# EAGLE design MCB-MTS-Dragonfly-v2.1.0 (EAGLE 7.7.0)

## Sheet 1 of 2
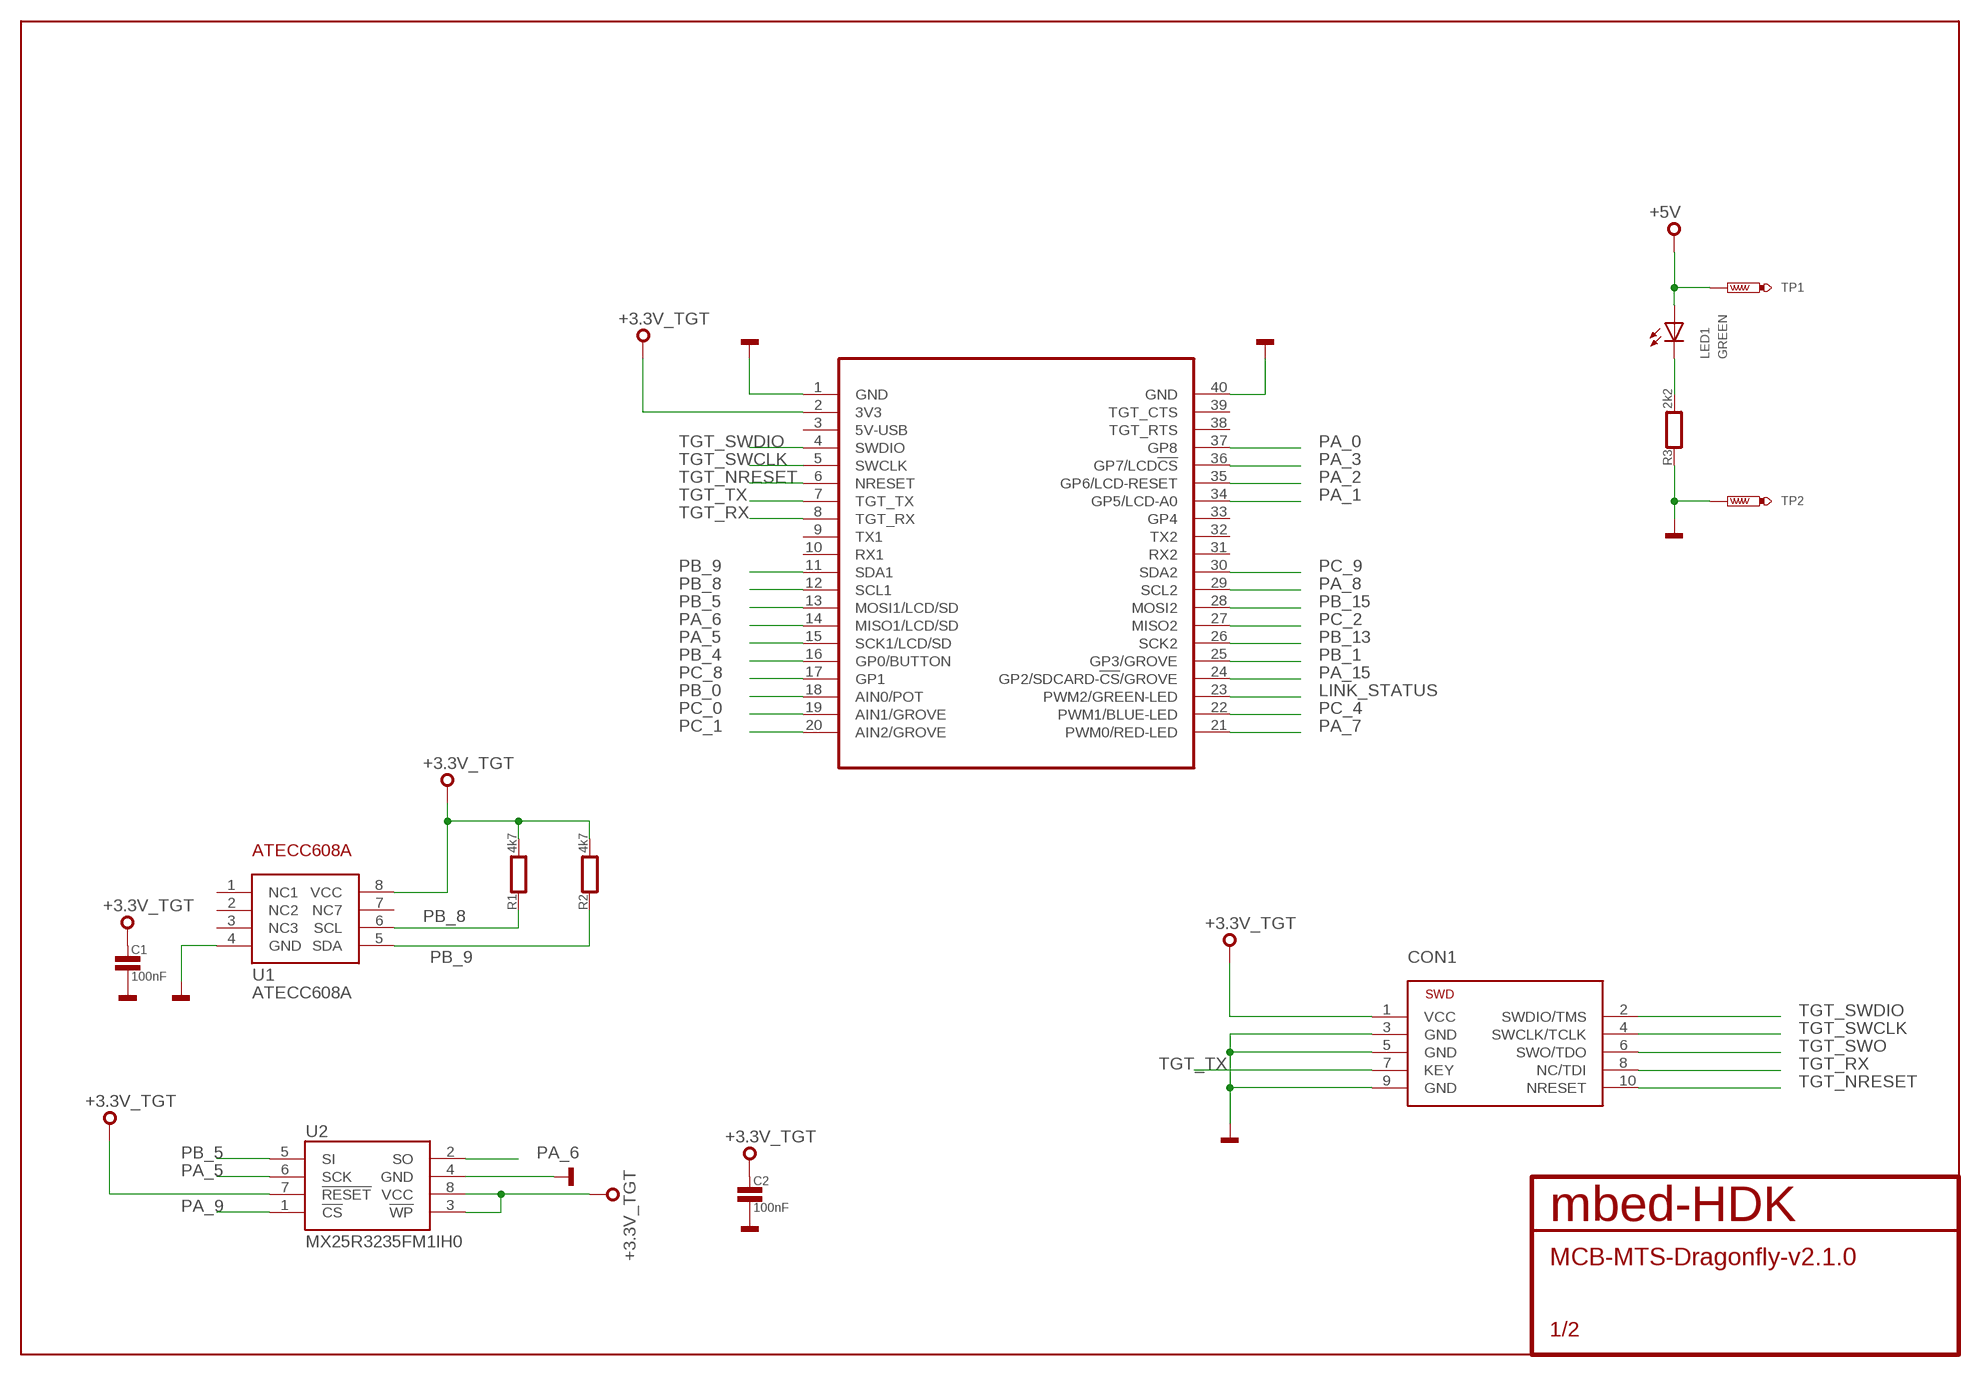
[diagram p0: schematic, sheet 1]

### Parts
C1  100nF  C0603  [0603]
C2  100nF  C0603  [0603]
CON1  SWD-10-SMD  [SWD-10-SMD]
LED1  GREEN  SMD_LED0603  [CHIPLED_0603]
MOD1  MODULE_DAUGHTER  [MODULE_DAUGHTER]
R1  4k7  R0603  [0603]
R2  4k7  R0603  [0603]
R3  2k2  R0603  [0603]
TP1  TEST_POINT-50R-PTH  [TP50-PTH]
TP2  TEST_POINT-50R-PTH  [TP50-PTH]
U1  ATECC608A  [SO8]
U2  MX25R3235FM1IH0  [SO8]

### Nets
+3.3V_TGT: C1.1 C2.1 CON1.1(VCC) MOD1.2(3V3) R1.2 R2.2 U1.8(VCC) U2.3(!WP) U2.7(!RESET) U2.8(VCC)
+5V: LED1.A TP1.TP ; also sheet 2
GND: C1.2 C2.2 CON1.3(GND) CON1.5(GND) CON1.9(GND) MOD1.1(GND) MOD1.40(GND) R3.1 TP2.TP U1.4(GND) U2.4(GND) ; also sheet 2
LINK_STATUS: MOD1.23(PWM2/GREEN-LED) ; also sheet 2
N$1: LED1.C R3.2
PA_0: MOD1.37(GP8) ; also sheet 2
PA_1: MOD1.34(GP5/LCD-A0) ; also sheet 2
PA_2: MOD1.35(GP6/LCD-RESET) ; also sheet 2
PA_3: MOD1.36(GP7/LCD!CS) ; also sheet 2
PA_5: MOD1.15(SCK1/LCD/SD) U2.6(SCK) ; also sheet 2
PA_6: MOD1.14(MISO1/LCD/SD) U2.2(SO) ; also sheet 2
PA_7: MOD1.21(PWM0/RED-LED) ; also sheet 2
PA_8: MOD1.29(SCL2) ; also sheet 2
PA_9: U2.1(!CS) ; also sheet 2
PA_15: MOD1.24(GP2/SDCARD-!CS!/GROVE) ; also sheet 2
PB_0: MOD1.18(AIN0/POT) ; also sheet 2
PB_1: MOD1.25(GP3/GROVE) ; also sheet 2
PB_4: MOD1.16(GP0/BUTTON) ; also sheet 2
PB_5: MOD1.13(MOSI1/LCD/SD) U2.5(SI) ; also sheet 2
PB_8: MOD1.12(SCL1) R1.1 U1.6(SCL) ; also sheet 2
PB_9: MOD1.11(SDA1) R2.1 U1.5(SDA) ; also sheet 2
PB_13: MOD1.26(SCK2) ; also sheet 2
PB_15: MOD1.28(MOSI2) ; also sheet 2
PC_0: MOD1.19(AIN1/GROVE) ; also sheet 2
PC_1: MOD1.20(AIN2/GROVE) ; also sheet 2
PC_2: MOD1.27(MISO2) ; also sheet 2
PC_4: MOD1.22(PWM1/BLUE-LED) ; also sheet 2
PC_8: MOD1.17(GP1) ; also sheet 2
PC_9: MOD1.30(SDA2) ; also sheet 2
TGT_NRESET: CON1.10(NRESET) MOD1.6(NRESET) ; also sheet 2
TGT_RX: CON1.8(NC/TDI) MOD1.8(TGT_RX) ; also sheet 2
TGT_SWCLK: CON1.4(SWCLK/TCLK) MOD1.5(SWCLK) ; also sheet 2
TGT_SWDIO: CON1.2(SWDIO/TMS) MOD1.4(SWDIO) ; also sheet 2
TGT_SWO: CON1.6(SWO/TDO) ; also sheet 2
TGT_TX: CON1.7(KEY) MOD1.7(TGT_TX) ; also sheet 2
Unconnected: MOD1.3(5V-USB) MOD1.9(TX1) MOD1.10(RX1) MOD1.31(RX2) MOD1.32(TX2) MOD1.33(GP4) MOD1.38(TGT_RTS) MOD1.39(TGT_CTS) U1.1(NC1) U1.2(NC2) U1.3(NC3) U1.7(NC7)

## Sheet 2 of 2
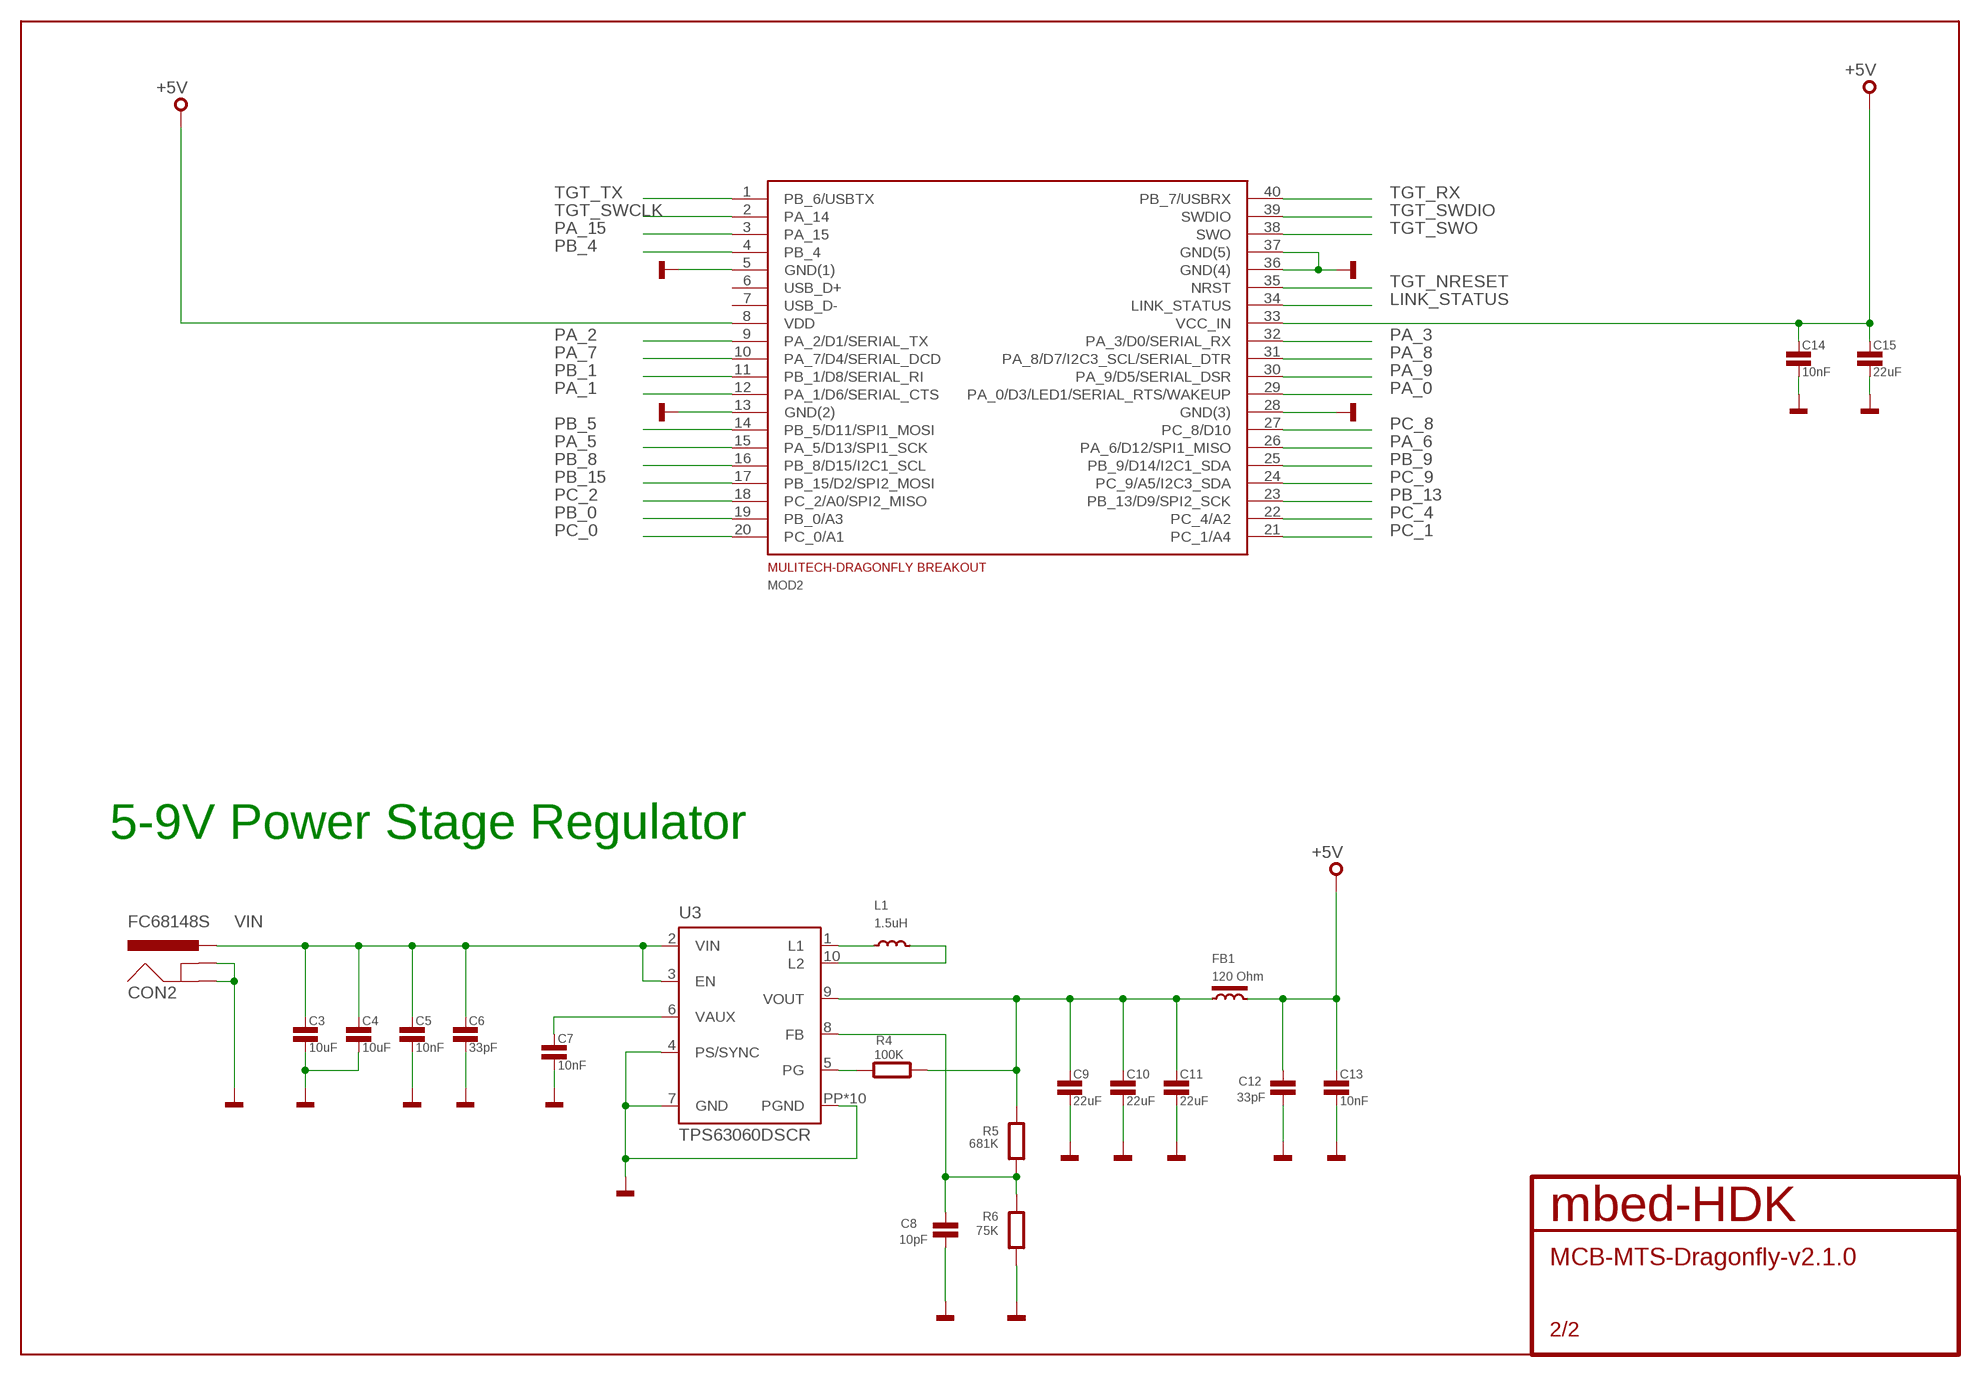
[diagram p1: schematic, sheet 2]

### Parts
C3  10uF  C0603  [0603]
C4  10uF  C0603  [0603]
C5  10nF  C0603  [0603]
C6  33pF  C0603  [0603]
C7  10nF  C0603  [0603]
C8  10pF  C0603  [0603]
C9  22uF  C0603  [0603]
C10  22uF  C0603  [0603]
C11  22uF  C0603  [0603]
C12  33pF  C0603  [0603]
C13  10nF  C0603  [0603]
C14  10nF  C0603  [0603]
C15  22uF  C0603  [0603]
CON2  FC68148S  [FC68148S]
FB1  120 Ohm  FB0603  [0603]
L1  1.5uH  INDUCTORXFL4020  [XFL4020-472MEC]
MOD2  MULITECH-DRAGONFLY-BREAKOUT  [MULITECH-DRAGONFLY-BREAKOUT]
R4  100K  R0603  [0603]
R5  681K  R0603  [0603]
R6  75K  R0603  [0603]
U3  TPS63060DSCR  [DSC-S-PWSON-N10]

### Nets
+5V: C12.1 C13.1 C14.1 C15.1 FB1.2 MOD2.8(VDD) MOD2.33(VCC_IN) ; also sheet 1
GND: C3.2 C4.2 C5.2 C6.2 C7.2 C8.2 C9.2 C10.2 C11.2 C12.2 C13.2 C14.2 C15.2 CON2.2(GNDBREAK) CON2.3(GND) MOD2.5(GND(1)) MOD2.13(GND(2)) MOD2.28(GND(3)) MOD2.36(GND(4)) MOD2.37(GND(5)) R6.1 U3.4(PS/SYNC) U3.7(GND) U3.PP(PGND) U3.PP@1(PGND) U3.PP@2(PGND) U3.PP@3(PGND) U3.PP@4(PGND) U3.PP@5(PGND) U3.PP@7(PGND) U3.PP@8(PGND) U3.PP@9(PGND) U3.PP@10(PGND) ; also sheet 1
LINK_STATUS: MOD2.34(LINK_STATUS) ; also sheet 1
N$17: C7.1 U3.6(VAUX)
N$18: L1.P$1 U3.1(L1)
N$19: L1.P$2 U3.10(L2)
N$20: C8.1 R5.1 R6.2 U3.8(FB)
N$21: C9.1 C10.1 C11.1 FB1.1 R4.2 R5.2 U3.9(VOUT)
N$23: R4.1 U3.5(PG)
PA_0: MOD2.29(PA_0/D3/LED1/SERIAL_RTS/WAKEUP) ; also sheet 1
PA_1: MOD2.12(PA_1/D6/SERIAL_CTS) ; also sheet 1
PA_2: MOD2.9(PA_2/D1/SERIAL_TX) ; also sheet 1
PA_3: MOD2.32(PA_3/D0/SERIAL_RX) ; also sheet 1
PA_5: MOD2.15(PA_5/D13/SPI1_SCK) ; also sheet 1
PA_6: MOD2.26(PA_6/D12/SPI1_MISO) ; also sheet 1
PA_7: MOD2.10(PA_7/D4/SERIAL_DCD) ; also sheet 1
PA_8: MOD2.31(PA_8/D7/I2C3_SCL/SERIAL_DTR) ; also sheet 1
PA_9: MOD2.30(PA_9/D5/SERIAL_DSR) ; also sheet 1
PA_15: MOD2.3(PA_15) ; also sheet 1
PB_0: MOD2.19(PB_0/A3) ; also sheet 1
PB_1: MOD2.11(PB_1/D8/SERIAL_RI) ; also sheet 1
PB_4: MOD2.4(PB_4) ; also sheet 1
PB_5: MOD2.14(PB_5/D11/SPI1_MOSI) ; also sheet 1
PB_8: MOD2.16(PB_8/D15/I2C1_SCL) ; also sheet 1
PB_9: MOD2.25(PB_9/D14/I2C1_SDA) ; also sheet 1
PB_13: MOD2.23(PB_13/D9/SPI2_SCK) ; also sheet 1
PB_15: MOD2.17(PB_15/D2/SPI2_MOSI) ; also sheet 1
PC_0: MOD2.20(PC_0/A1) ; also sheet 1
PC_1: MOD2.21(PC_1/A4) ; also sheet 1
PC_2: MOD2.18(PC_2/A0/SPI2_MISO) ; also sheet 1
PC_4: MOD2.22(PC_4/A2) ; also sheet 1
PC_8: MOD2.27(PC_8/D10) ; also sheet 1
PC_9: MOD2.24(PC_9/A5/I2C3_SDA) ; also sheet 1
TGT_NRESET: MOD2.35(NRST) ; also sheet 1
TGT_RX: MOD2.40(PB_7/USBRX) ; also sheet 1
TGT_SWCLK: MOD2.2(PA_14) ; also sheet 1
TGT_SWDIO: MOD2.39(SWDIO) ; also sheet 1
TGT_SWO: MOD2.38(SWO) ; also sheet 1
TGT_TX: MOD2.1(PB_6/USBTX) ; also sheet 1
VIN: C3.1 C4.1 C5.1 C6.1 CON2.1-1(PWR) CON2.1-2(PWR) U3.2(VIN) U3.3(EN)
Unconnected: MOD2.6(USB_D+) MOD2.7(USB_D-)

### Notes on the sheet
- 5-9V Power Stage Regulator

## Library data of the parts
C1-C15 = mbed-HDK-RLC:C: Capacitor
CON1 = mbed-HDK-Connector:SWD-10: 1.27 mm pitch 10-Pin Cortex Programming Header
CON2 = mbed-HDK-Connector:FC68148S: Power Jack This is the standard 5.5mm barrel jack for power. The PTH is the most common, proven, reliable, footprint. The Slot footprint only works if the mill layer is transmitted to the PCB fab house so be warned. Mating wall wart : TOL-00298 (and others); MF: Cliff; MFN: FC68148S; OC_NEWARK: 1889309
FB1 = mbed-HDK-RLC:FB: Ferrite Bead
L1 = mbed-HDK-RLC:INDUCTOR: Inductor; MF: CoilCraft; MFN: XFL4020-472MEC; OC-NEWARK: 2289218
LED1 = mbed-HDK-Optical:SMD_LED: LED SMD, Colour Red; MF: Wurth Electronics Inc; MFN: 150060RS75000; OC-DIGIKEY: 732-4978-1-ND; OC-MOUSER: 710-150060RS75000; OC-NEWARK: 2322071
MOD1 = mbed-HDK-misc-Board:MODULE_DAUGHTER
MOD2 = mbed-HDK-MF-MULTITECH:MULITECH-DRAGONFLY-BREAKOUT: Breakout for Multitech Dragonfly; MF: Hirose; MFN: DF17(2.0)-40DP-0.5V(57); OC-DIGIKEY: H11130CT-ND; OC-MOUSER: 798-DF172040DP05V57; OC-NEWARK: 2300341
R1-R6 = mbed-HDK-RLC:R: Resistor
TP1 TP2 = mbed-HDK-Test:TEST_POINT
U1 = mbed-HDK-MF-ATMEL:ATECC608A: I2C Secure element and crytpo accelerator; MF: Atmel; MFN: ATECC608A; OC-DIGIKEY: ATECC608A-SSHDA-TCT-ND; OC-MOUSER: 556-ATECC608ASSHDAB
U2 = mbed-HDK-IC:MX25R3235FM1IH0: Serial Flash 32 Mb 80 Mhz; MF: Macronix; MFN: MX25R3235FM1IH0; OC-DIGIKEY: 1092-1175-ND
U3 = mbed-HDK-Power:TPS63060DSCR: Buck Boost Conveter (2.5V-12Vin, 2.5V-8Vout, 2Aout); MF: TEXAS INSTRUMENTS; MFN: TPS63060DSCR; OC-DIGIKEY: 296-30204-1-ND; OC-MOUSER: 595-TPS63060DSCR; OC-NEWARK: 76T8143

## Board
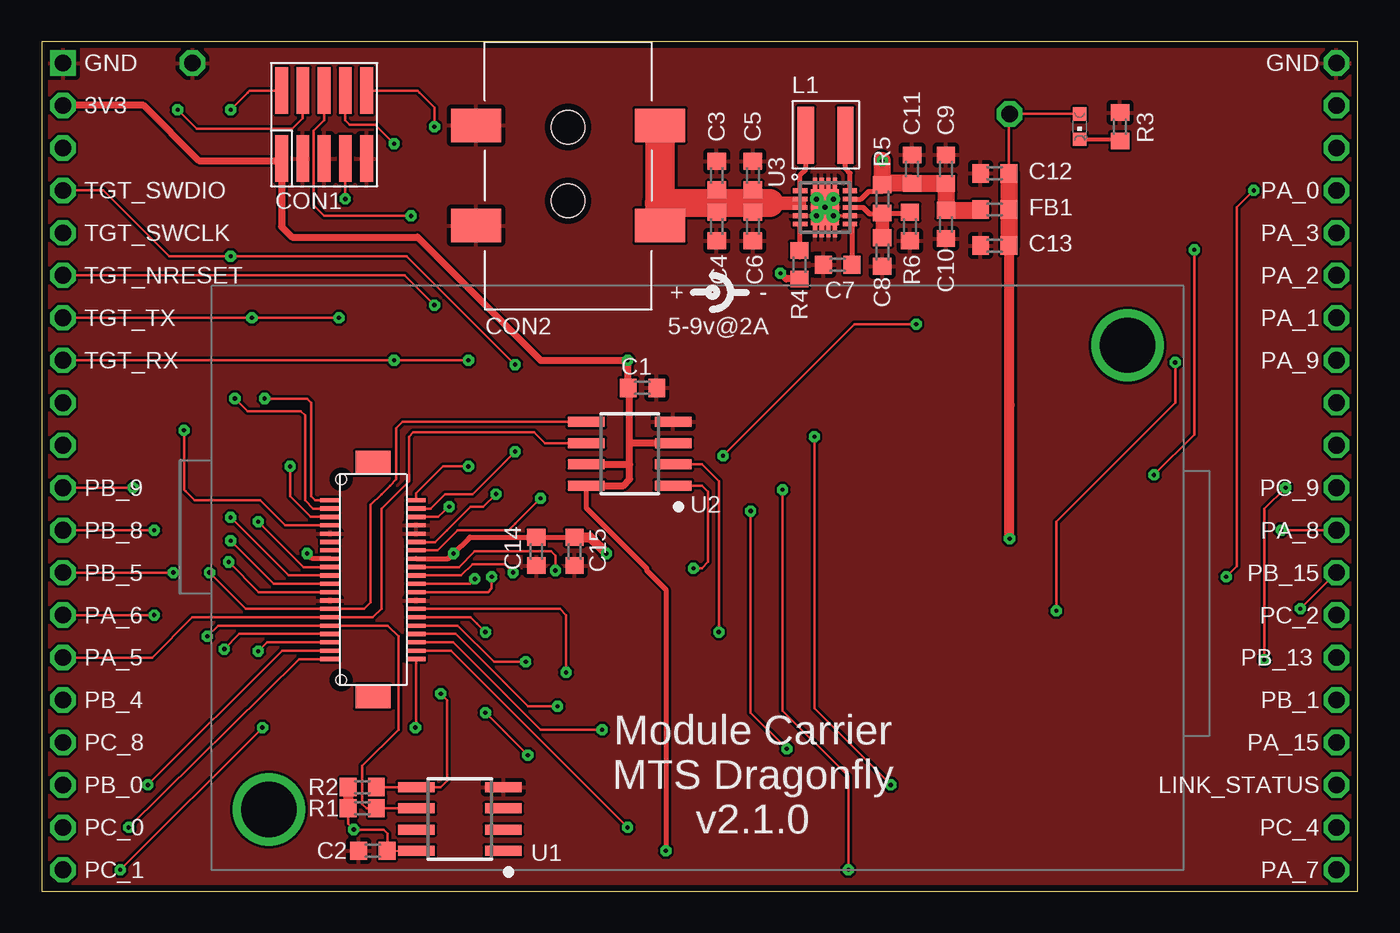
[diagram p2: board, top side]
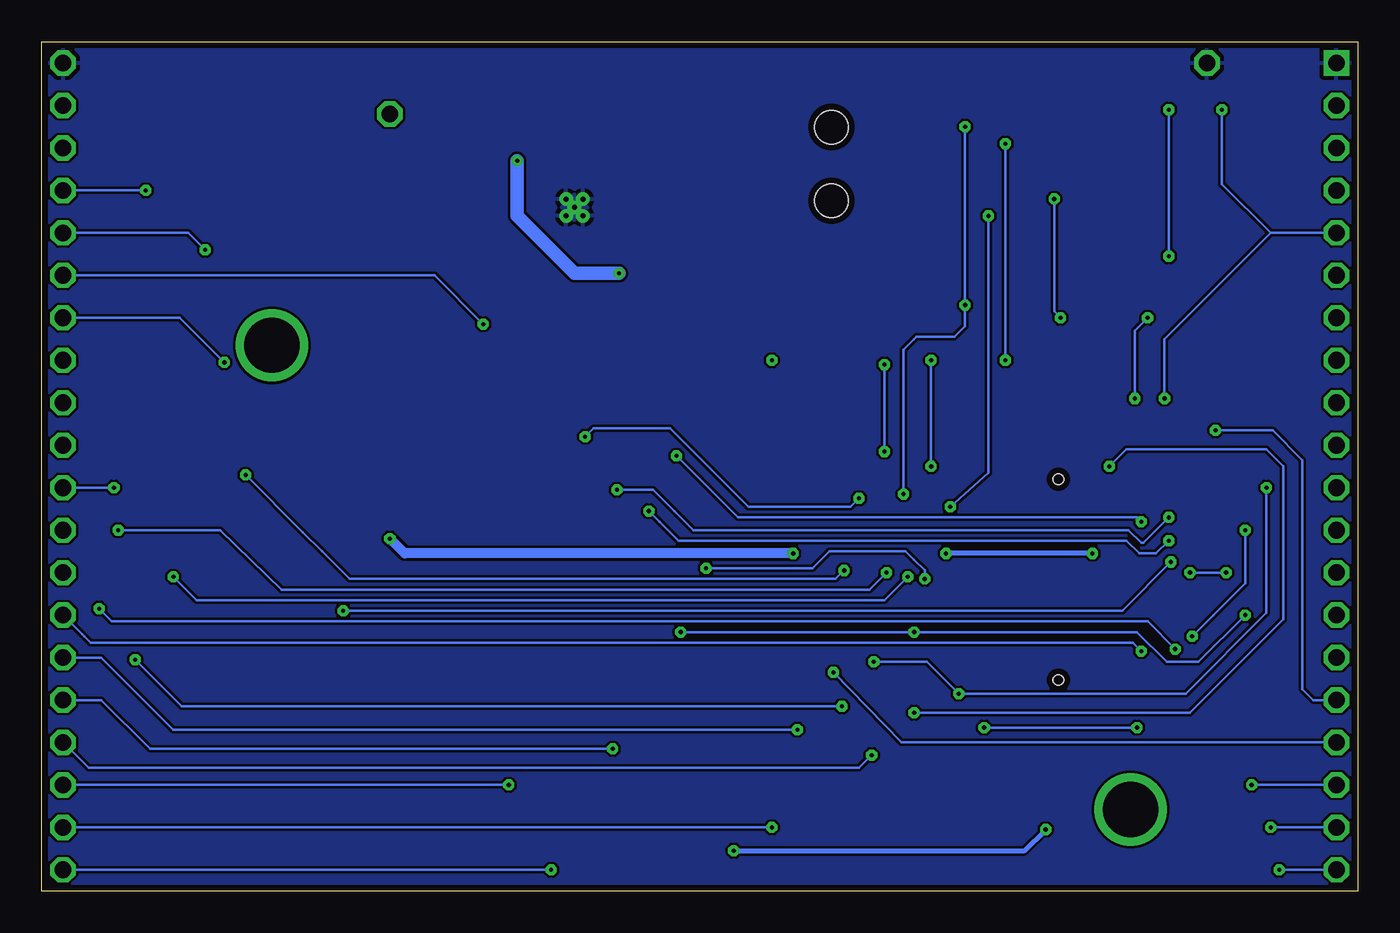
[diagram p3: board, bottom side, seen from below]

Size 78.74 x 50.8 mm. Coordinates in mm from the lower left corner, seen from the top.
Copper layers ((1*16)): Top 0.035mm / dielectric 0.8mm / Bottom 0.035mm
Design rules "mbed-HDK-6-6-2-layer": minimum track width 6mil, minimum drill 9mil, track to track 6mil, track to pad 6mil, pad to pad 6mil, via to via 6mil, smd to smd 6mil, copper to edge 15mil, drill to drill 8mil, minimum pad ring 10mil, minimum via ring 8mil, stop-mask expansion 4mil, vias tented up to drill 0mil, thermal gap 10mil

### Footprints (pad centres in the part's own frame; a part is rotated, then mirrored left to right if it is on the bottom)
0603 = smd 1 x 1.1: 1 -0.85,0; 2 0.85,0
SWD-10-SMD = smd 0.762 x 2.794: 1 0.381,-2.032; 2 0.381,2.032; 3 1.651,-2.032; 4 1.651,2.032; 5 2.921,-2.032; 6 2.921,2.032; 7 4.191,-2.032; 8 4.191,2.032; 9 5.461,-2.032; 10 5.461,2.032
FC68148S = smd 3 x 2: 1-1 5.5,-5; 1-2 5.5,-11; 2 -5.5,-11; 3 -5.5,-5 | hole 2: 0,-5.1; 0,-9.5
XFL4020-472MEC = smd 0.98 x 3.4: P$1 0,0; P$2 2.37,0
CHIPLED_0603 = smd 0.8 x 0.8: A 0,-0.75; C 0,0.75
MODULE_DAUGHTER = drill 1 square: 1 0,0 | drill 1 octagon: 2 0,-2.54; 3 0,-5.08; 4 0,-7.62; 5 0,-10.16; 6 0,-12.7; 7 0,-15.24; 8 0,-17.78; 9 0,-20.32; 10 0,-22.86; 11 0,-25.4; 12 0,-27.94; 13 0,-30.48; 14 0,-33.02; 15 0,-35.56; 16 0,-38.1; 17 0,-40.64; 18 0,-43.18; 19 0,-45.72; 20 0,-48.26; 21 76.2,-48.26; 22 76.2,-45.72; 23 76.2,-43.18; 24 76.2,-40.64; 25 76.2,-38.1; 26 76.2,-35.56; 27 76.2,-33.02; 28 76.2,-30.48; 29 76.2,-27.94; 30 76.2,-25.4; 31 76.2,-22.86; 32 76.2,-20.32; 33 76.2,-17.78; 34 76.2,-15.24; 35 76.2,-12.7; 36 76.2,-10.16; 37 76.2,-7.62; 38 76.2,-5.08; 39 76.2,-2.54; 40 76.2,0
MULITECH-DRAGONFLY-BREAKOUT = smd 0.25 x 1.15: 1 -22.11,7.08; 2 -21.61,7.08; 3 -21.11,7.08; 4 -20.61,7.08; 5 -20.11,7.08; 6 -19.61,7.08; 7 -19.11,7.08; 8 -18.61,7.08; 9 -18.11,7.08; 10 -17.61,7.08; 11 -17.11,7.08; 12 -16.61,7.08; 13 -16.11,7.08; 14 -15.61,7.08; 15 -15.11,7.08; 16 -14.61,7.08; 17 -14.11,7.08; 18 -13.61,7.08; 19 -13.11,7.08; 20 -12.61,7.08; 21 -12.61,12.23; 22 -13.11,12.23; 23 -13.61,12.23; 24 -14.11,12.23; 25 -14.61,12.23; 26 -15.11,12.23; 27 -15.61,12.23; 28 -16.11,12.23; 29 -16.61,12.23; 30 -17.11,12.23; 31 -17.61,12.23; 32 -18.11,12.23; 33 -18.61,12.23; 34 -19.11,12.23; 35 -19.61,12.23; 36 -20.11,12.23; 37 -20.61,12.23; 38 -21.11,12.23; 39 -21.61,12.23; 40 -22.11,12.23 | drill 3.3: P$1 -31.37,54.81; P$2 -3.61,3.43 | smd 1.4 x 2.1: P$43 -24.36,9.655; P$44 -10.36,9.655 | hole 0.6: -11.36,7.755; -23.36,7.755
TP50-PTH = drill 1 octagon: TP 0,0
SO8 = smd 0.6 x 2.2: 1 -1.905,-2.6; 2 -0.635,-2.6; 3 0.635,-2.6; 4 1.905,-2.6; 5 1.905,2.6; 6 0.635,2.6; 7 -0.635,2.6; 8 -1.905,2.6
DSC-S-PWSON-N10 = smd 0.85 x 0.28: 1 -1.488,1; 2 -1.488,0.5; 3 -1.488,0; 4 -1.488,-0.5; 5 -1.488,-1; 6 1.5,-1; 7 1.5,-0.5; 8 1.5,0; 9 1.5,0.5; 10 1.5,1 | smd 1.7 x 2.15: PP 0,0 | smd 0.25 x 3.55: PP@1 0.6,0; PP@2 0.2,0; PP@3 -0.2,0; PP@4 -0.6,0 | drill 0.3 pad 0.4: PP@5 0.5,0.5; PP@7 0,0; PP@8 0.5,-0.5; PP@9 -0.5,0.5; PP@10 -0.5,-0.5

### Placement (x,y rotation side)
C1  35.94,30.1 0 top
C2  19.81,2.41 180 top
C3  40.39,42.8 90 top
C4  40.39,39.75 270 top
C5  42.55,39.75 270 top
C6  42.55,42.8 90 top
C7  47.62,37.47 180 top
C8  50.29,38.23 270 top
C9  54.1,43.18 90 top
C10  54.1,39.88 270 top
C11  52.07,43.18 90 top
C12  57.02,42.93 180 top
C13  57.02,38.61 180 top
C14  29.59,20.32 270 top
C15  31.88,20.32 270 top
CON1  13.97,45.85 0 top
CON2  31.5,50.8 0 top
FB1  57.02,40.77 0 top
L1  45.72,45.21 0 top
LED1  62.1,45.72 180 top
MOD1  1.27,49.53 0 top
MOD2  10.16,1.27 270 top
R1  19.18,4.95 180 top
R2  19.18,6.22 180 top
R3  64.52,45.72 270 top
R4  45.34,37.47 270 top
R5  50.29,41.4 90 top
R6  51.94,39.75 90 top
TP1  57.91,46.48 0 top
TP2  9.02,49.53 0 top
U1  25.02,4.32 90 top
U2  35.18,26.16 90 top
U3  46.86,40.89 0 top

### Tracks (layer width: path | path; a pad name or v marks a point on that pad's centre or on a via)
+3.3V_TGT  (via drill 0.25, 0.25 pad 0.25)
  Top 0.152: U1.8 21.68,2.39 C2.1 20.7,2.45 20.7,3.43 20.45,3.68 v18.67,3.68 18.33,4.02 R1.2 | 35.18,30.01 C1.1 | 35.31,26.8 35.18,26.67 | 35.09,31.71 v35.05,31.75
  Top 0.305: U2.8 32.58,22.92 36.2,19.3 36.2,19.18 37.34,18.03 37.34,2.67 v37.34,2.41
  Top 0.406: MOD1.2 6.1,46.99 9.4,43.69 14.22,43.69 CON1.1 14.35,39.75 14.99,39.12 22.48,39.12 29.84,31.75 v35.05,31.75 | U2.8 34.8,24.26 35.18,24.64 35.18,25.53 | 35.18,25.53 35.18,26.67 35.18,30.01 | U2.7 35.18,25.53 | U2.3 35.31,26.8 | C1.1 35.09,31.71
  Top 0.61: R2.2 R1.2
  Bottom 0.305: v37.34,2.41 19.94,2.41 v18.67,3.68
+5V  (via drill 0.25, 0.25 pad 0.25)
  Top 0.152: C12.1 57.87,46.44 TP1.TP 62.09,46.48 LED1.A
  Top 0.305: C15.1 C14.1 25.61,21.17 25.53,21.08 v24.64,20.19 24.32,19.88 MOD2.33 | MOD2.8 16.19,19.88 v15.88,20.19
  Top 0.61: C15.1 32.8,21.17 v33.78,20.19 | v57.91,21.08 57.91,29.08 57.91,38.57 C13.1
  Top 1.016: C12.1 FB1.2 C13.1
  Bottom 0.305: v15.88,20.19 v24.64,20.19
  Bottom 0.61: v33.78,20.19 57.02,20.19 v57.91,21.08
GND
  Top 0.152: U3.7 U3.PP@8 | U3.PP@8 47.36,40.59 U3.PP@2 | U3.PP@1 47.46,40.49 U3.PP@8 | U3.PP@4 U3.PP@3 | U3.PP@3 U3.PP@7 | U3.PP@7 U3.PP@2 | U3.PP@2 U3.PP@7 | U3.PP@3 U3.PP@7
  pour Bottom: 0,0 78.74,0 78.74,50.8 0,50.8
  pour Top: 0,0 78.74,0 78.74,50.8 0,50.8
LINK_STATUS  (via drill 0.25)
  Top 0.152: MOD2.34 23.68,20.38 24.89,21.59 27.94,21.59 28.32,21.97 v29.84,23.5 | v50.8,6.35 46.23,10.92 v46.23,27.18
  Bottom 0.152: MOD1.23 v50.8,6.35 | v29.84,23.5 30.35,22.99 30.48,22.99 36.45,22.99 41.15,27.69 45.72,27.69 v46.23,27.18
N$1
  Top 0.254: LED1.C 64.52,44.97 R3.2
N$17
  Top 0.305: U3.6 48.48,39.78 C7.1
N$18
  Top 0.305: U3.1 45.38,42.84 45.72,43.18 L1.P$1
N$19
  Top 0.305: U3.10 48.36,42.95 48.09,43.22 L1.P$2
N$20
  Top 0.305: U3.8 49.15,40.89 49.53,40.51 50.25,40.51 R5.1 51.89,40.55 R6.2
  Top 0.813: R5.1 C8.1
N$21  (via drill 0.25)
  Top 0.152: 50.38,42.33 50.37,42.33 R5.2
  Top 0.305: U3.9 49.01,41.39 49.48,41.86 50.29,41.86 R5.2 50.29,42.42
  Top 0.406: R4.2 44.54,36.62 v44.2,36.96
  Top 1.016: v50.29,43.69 50.29,42.42 50.38,42.33 C11.1 C9.1 C10.1 56.13,40.73 FB1.1
  Bottom 0.813: v50.29,43.69 50.29,40.39 46.86,36.96 v44.2,36.96
N$23
  Top 0.152: R4.1 45.34,38.23
  Top 0.305: U3.5 45.34,39.86 R4.1 45.34,38.23 45.34,37.92
PA_0  (via drill 0.25, 0.25 pad 0.25)
  Top 0.152: MOD2.29 26.7,17.88 26.92,18.11 v26.92,18.8 | v70.87,18.8 71.5,19.43 71.5,40.89 v72.52,41.91
  Bottom 0.152: v26.92,18.8 28.32,17.4 69.47,17.4 v70.87,18.8 | v72.52,41.91 MOD1.37
PA_1  (via drill 0.25)
  Top 0.152: v67.82,31.62 67.82,29.21 60.71,22.1 v60.71,16.76 | MOD2.12 12.98,17.88 v11.18,19.69
  Bottom 0.152: MOD1.34 70.48,34.29 v67.82,31.62 | v60.71,16.76 60.33,16.76 14.1,16.76 v11.18,19.69
PA_2  (via drill 0.25)
  Top 0.152: v40.77,26.04 48.64,33.91 v52.32,33.91 | MOD2.9 15.67,19.38 v12.95,22.1
  Bottom 0.152: v12.95,22.1 13.21,22.35 36.96,22.35 37.08,22.35 v40.77,26.04 | v52.32,33.91 55.25,36.83 MOD1.35
PA_3  (via drill 0.25)
  Top 0.152: v68.96,38.35 68.96,27.3 v66.55,24.89 | MOD2.32 24.97,19.38 25.91,20.32 30.48,20.32 30.73,20.07 v30.73,19.18
  Bottom 0.152: v30.73,19.18 31.24,18.67 60.33,18.67 61.98,20.32 63.12,21.46 v66.55,24.89 | MOD1.36 69.98,39.37 v68.96,38.35
PA_5
  Top 0.152: MOD1.15 6.6,13.97 9.01,16.38 MOD2.15 19.81,16.38 20.32,16.89 20.32,22.86 21.97,24.51 21.97,27.18 22.22,27.43 29.46,27.43 30.1,26.8 U2.6
PA_6  (via drill 0.25, 0.25 pad 0.25)
  Top 0.152: MOD2.26 25.66,16.38 26.04,16 v26.54,15.49 | MOD1.14 v6.73,16.51 | U2.2 39.5,25.53 40.51,24.51 v40.51,15.49
  Bottom 0.152: v6.73,16.51 9.53,13.72 11.43,13.72 13.21,15.49 v26.54,15.49 v40.51,15.49
PA_7  (via drill 0.25)
  Top 0.152: v44.32,24 44.32,10.8 48.26,6.86 v48.26,1.27 | MOD2.10 14.78,18.88 v11.3,22.35
  Bottom 0.152: v11.3,22.35 12.83,20.83 12.95,20.83 13.72,21.59 39.75,21.59 40.89,22.73 42.16,24 v44.32,24 | v48.26,1.27 MOD1.21
PA_8  (via drill 0.25)
  Top 0.152: v74.17,21.59 MOD1.29 | MOD2.31 23.54,18.88 25.1,18.88 25.78,19.56 27.05,19.56 27.69,19.56 v28.19,19.05
  Bottom 0.152: v28.19,19.05 29.21,18.03 64.39,18.03 68.07,21.59 v74.17,21.59
PA_9  (via drill 0.25, 0.25 pad 0.25)
  Top 0.152: MOD2.30 25.62,18.38 v25.91,18.67 | v38.99,19.3 39.5,19.3 39.88,19.69 39.88,23.88 39.5,24.26 U2.1
  Bottom 0.152: v25.91,18.67 25.91,19.18 26.54,19.81 27.05,20.32 31.62,20.32 32.64,19.3 v38.99,19.3
PA_15  (via drill 0.25)
  Top 0.152: v29.08,8.13 v26.54,10.67 | MOD2.3 16.1,22.38 14.86,23.62 v14.86,25.4
  Bottom 0.152: MOD1.24 75.95,7.37 29.84,7.37 v29.08,8.13 | v26.54,10.67 10.03,10.67 4.45,16.26 4.45,25.4 5.46,26.42 13.84,26.42 v14.86,25.4
PB_0  (via drill 0.25)
  Top 0.152: MOD2.19 14.38,14.38 v6.35,6.35
  Bottom 0.152: v6.35,6.35 MOD1.18
PB_1  (via drill 0.25)
  Top 0.152: v42.42,22.73 42.42,10.67 v44.58,8.51 | MOD2.11 13.88,18.38 v11.3,20.96
  Bottom 0.152: v11.3,20.96 12.06,20.19 13.08,20.19 13.84,20.96 40.64,20.96 41.78,22.1 v42.42,22.73 | MOD1.25 75.18,11.43 72.26,8.51 v44.58,8.51
PB_4  (via drill 0.25)
  Top 0.152: v8.51,27.56 8.51,24 8.6,23.91 9.14,23.37 13.08,23.37 14.57,21.88 MOD2.4
  Bottom 0.152: MOD1.16 2.67,11.43 3.3,12.06 3.3,25.78 5.08,27.56 v8.51,27.56
PB_5  (via drill 0.25)
  Top 0.152: v10.03,19.05 12.2,16.88 MOD2.14 19.29,16.88 19.68,17.27 19.68,23.11 20.32,23.75 20.83,24.26 21.21,24.64 21.21,27.69 21.59,28.07 U2.5 | MOD1.13 v7.87,19.05
  Bottom 0.152: v7.87,19.05 v10.03,19.05
PB_8  (via drill 0.25)
  Top 0.152: v9.91,15.24 10.55,15.88 MOD2.16 20.7,15.88 21.34,15.24 21.34,11.43 21.34,10.03 21.34,9.65 19.18,7.49 19.18,5.21 19.43,4.95 R1.1 U1.6 | MOD1.12 v6.73,21.59
  Bottom 0.152: v9.91,15.24 8.64,16.51 6.73,18.42 v6.73,21.59
PB_9  (via drill 0.25)
  Top 0.152: MOD2.25 24.89,15.88 27.05,13.72 v28.96,13.72 | v5.46,24.13 MOD1.11 | R2.1 U1.5 23.88,6.22 24.26,6.6 24.26,11.43 v23.88,11.81
  Bottom 0.152: v28.96,13.72 25.78,13.72 v23.88,11.81 10.29,11.81 5.46,16.64 v5.46,24.13
PB_13  (via drill 0.25)
  Top 0.152: MOD2.23 24.62,14.88 29.84,9.65 v33.53,9.65
  Bottom 0.152: v33.53,9.65 70.87,9.65 75.18,13.97 MOD1.26
PB_15  (via drill 0.25)
  Top 0.152: MOD1.28 v75.31,16.89 | MOD2.17 11.82,15.38 v10.92,14.48
  Bottom 0.152: v10.92,14.48 12.57,16.13 27.43,16.13 28.45,16.13 74.55,16.13 v75.31,16.89
PC_0  (via drill 0.25)
  Top 0.152: MOD2.20 15.4,13.88 v5.21,3.81
  Bottom 0.152: v5.21,3.81 MOD1.19
PC_1  (via drill 0.25)
  Top 0.152: MOD2.21 22.39,9.56 v22.35,9.78 | v13.21,9.78 v4.7,1.27
  Bottom 0.152: v22.35,9.78 v13.21,9.78 | v4.7,1.27 MOD1.20
PC_2  (via drill 0.25)
  Top 0.152: MOD2.18 13.48,14.88 v12.95,14.35
  Bottom 0.152: MOD1.27 76.33,15.37 | 76.33,15.37 76.2,15.24 | v12.95,14.35 13.46,14.86 75.82,14.86 76.33,15.37
PC_4  (via drill 0.25)
  Top 0.152: MOD2.22 24.48,14.38 v35.05,3.81
  Bottom 0.152: v35.05,3.81 MOD1.22
PC_8  (via drill 0.25)
  Top 0.152: MOD2.27 24.9,16.88 29.09,16.88 31,16.88 31.37,16.51 v31.37,13.08
  Bottom 0.152: v31.37,13.08 27.3,8.89 MOD1.17
PC_9  (via drill 0.25)
  Top 0.152: MOD2.24 24.75,15.38 29.08,11.05 v30.86,11.05 | v73.15,13.84 73.15,22.86 v74.42,24.13
  Bottom 0.152: v74.42,24.13 MOD1.30 | v30.86,11.05 70.36,11.05 v73.15,13.84
TGT_NRESET  (via drill 0.25)
  Top 0.152: MOD1.6 20.45,36.83 21.72,36.83 v23.5,35.05 | v27.18,23.75 26.42,22.99 25.65,22.99 24.26,21.59 23.55,20.88 MOD2.35 | v23.5,45.72 23.5,46.86 22.61,47.75 22.48,47.88 CON1.10
  Bottom 0.152: v27.18,23.75 27.18,32.39 26.54,33.02 26.42,33.15 24.13,33.15 23.5,33.78 v23.5,35.05 v23.5,45.72
TGT_RX  (via drill 0.25)
  Top 0.152: MOD1.8 v21.08,31.75 v25.53,31.75 | v21.08,44.7 19.94,45.85 18.41,45.85 18.16,46.1 CON1.8 | MOD2.40 22.39,23.79 24,25.4 v25.53,25.4
  Bottom 0.152: v25.53,25.4 v25.53,31.75 | v21.08,44.7 v21.08,31.75
TGT_SWCLK  (via drill 0.25)
  Top 0.152: v8.13,46.74 9.27,45.59 14.99,45.59 15.62,46.23 CON1.4 | MOD2.2 16.24,22.88 15.75,23.37 15.75,28.45 15.49,28.7 12.32,28.7 v11.56,29.46
  Bottom 0.152: v11.56,29.46 11.56,33.02 5.21,39.37 | 5.21,39.37 MOD1.5 | v8.13,46.74 8.13,42.29 5.21,39.37
TGT_SWDIO  (via drill 0.25)
  Top 0.152: MOD1.4 3.68,41.91 7.62,37.97 v11.3,37.97 19.56,37.97 20.95,37.97 21.84,37.97 v28.32,31.5 | v28.32,26.29 25.78,23.75 25.15,23.75 24.13,23.75 23.26,22.88 MOD2.39 | v11.3,46.74 12.32,47.75 12.45,47.88 CON1.2
  Bottom 0.152: v11.3,46.74 v11.3,37.97 | v28.32,31.5 v28.32,26.29
TGT_SWO  (via drill 0.25)
  Top 0.152: MOD2.38 23.72,22.38 v24.38,22.99 | v22.1,40.39 16.89,40.39 16.26,41.02 16.26,45.47 16.89,46.1 CON1.6
  Bottom 0.152: v22.1,40.39 22.1,25.02 v24.38,22.99
TGT_TX  (via drill 0.25)
  Top 0.152: MOD1.7 v12.57,34.29 v17.78,34.29 | MOD2.1 16.37,23.38 16.13,23.62 16.13,29.21 15.88,29.46 v13.33,29.46 | CON1.7 v18.16,41.4
  Bottom 0.152: v13.33,29.46 13.33,33.53 v12.57,34.29 | v18.16,41.4 18.16,34.67 v17.78,34.29
VIN
  Top 0.254: U3.2 U3.3 45.38,41.15 45.34,41.15 | 42.68,41.11 43.05,41.11 43.05,41.95 C6.1 | 42.68,41.11 40.26,41.13 | 40.26,41.13 36.96,41.15 | 43.35,41.15 43.56,41.15 | C4.1 C3.1 40.26,41.95 40.26,41.13 | C5.1 42.68,40.6 42.68,41.11
  Top 0.813: 45.34,41.15 43.56,41.15
  Top 1.676: 43.56,41.15 36.96,41.15
  Top 1.778: CON2.1-1 CON2.1-2 37,41.15 36.96,41.15

### Text on the board
tPlace: GND / 3V3 / / TGT_SWDIO / TGT_SWCLK / TGT_NRESET / TGT_TX / TGT_RX / / / PB_9 / PB_8 / PB_5 / PA_6 / PA_5 / PB_4 / PC_8 / PB_0 / PC_0 / PC_1 | GND / / / PA_0 / PA_3 / PA_2 / PA_1 / PA_9 / / / PC_9 / PA_8 / PB_15 / PC_2 / PB_13 / PB_1 / PA_15 / LINK_STATUS / PC_4 / PA_7 | + | - | 5-9v@2A | Module Carrier / MTS Dragonfly / v2.1.0